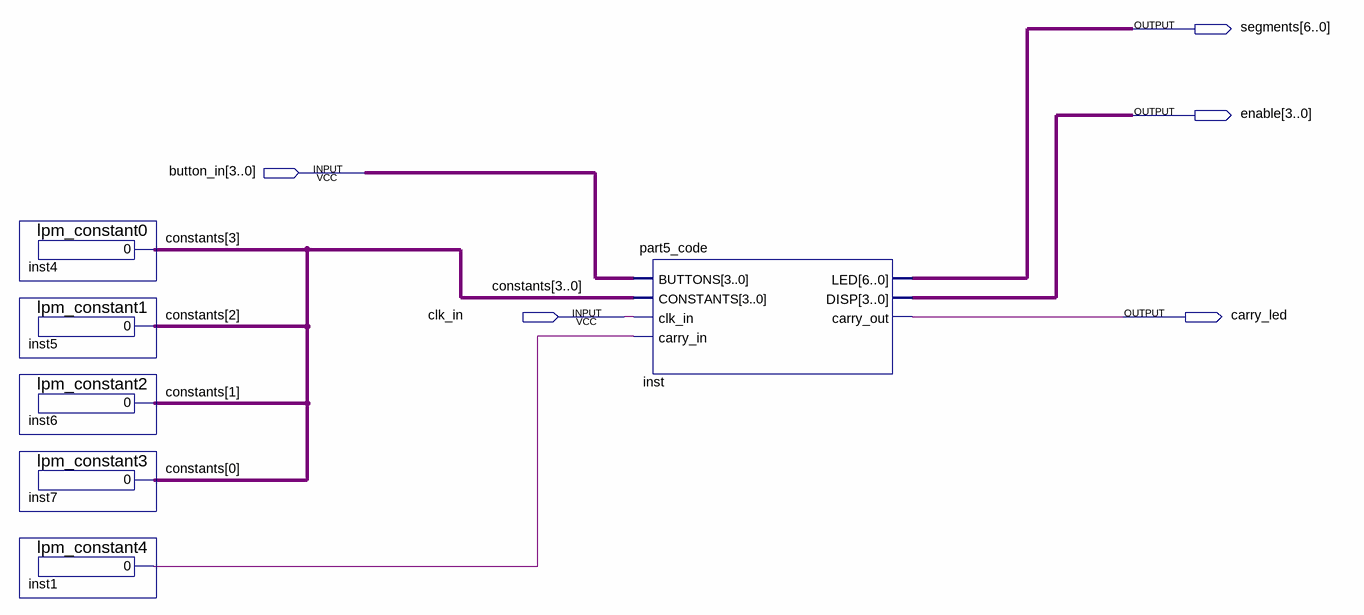
[diagram p0: schematic sheet]
// Quartus schematic part5.bdf as structural Verilog: 6 symbols, 5 pins
module part5 (
  input  [3:0] button_in,
  input  clk_in,
  output [6:0] segments,
  output [3:0] enable,
  output carry_led
);

  wire inst1_result;
  wire [3:0] constants;

  lpm_constant0 inst4 (.result(constants[3]));
  lpm_constant1 inst5 (.result(constants[2]));
  lpm_constant2 inst6 (.result(constants[1]));
  lpm_constant3 inst7 (.result(constants[0]));
  lpm_constant4 inst1 (.result(inst1_result));
  part5_code inst (
    .BUTTONS(button_in), .CONSTANTS(constants), .clk_in(clk_in), .carry_in(inst1_result), .LED(segments),
    .DISP(enable), .carry_out(carry_led));
endmodule
